# EAGLE design SATELLITE (EAGLE 8.5.1)
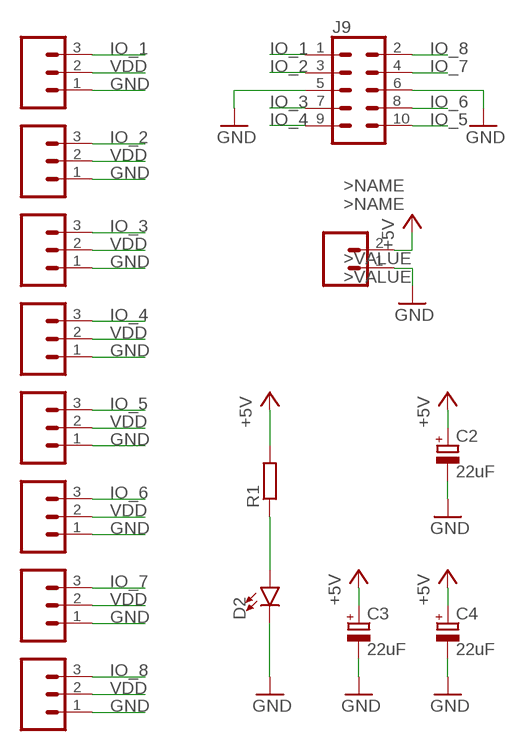
[diagram p0: schematic, sheet 1]

## Parts
C2  22uF  CPOL-EUE2-5  [E2-5]
C3  22uF  CPOL-EUE2-5  [E2-5]
C4  22uF  CPOL-EUE2-5  [E2-5]
D2  LED3MM  [LED_3MM]
J1  CONN_03POLAR  [MOLEX-1X3]
J2  CONN_03POLAR  [MOLEX-1X3]
J3  CONN_03POLAR  [MOLEX-1X3]
J4  CONN_03POLAR  [MOLEX-1X3]
J5  CONN_03POLAR  [MOLEX-1X3]
J6  CONN_03POLAR  [MOLEX-1X3]
J7  CONN_03POLAR  [MOLEX-1X3]
J8  CONN_03POLAR  [MOLEX-1X3]
J9  CONN_05X2SHD  [2X5-SHROUDED]
J10  CONN_02POLAR  [MOLEX-1X2]
R1  R-EU_0204/7  [0204/7]

## Nets
GND: C2.- C3.- C4.- D2.K(C) J1.1 J2.1 J3.1 J4.1 J5.1 J6.1 J7.1 J8.1 J9.5 J9.6 J10.1
IO_1: J7.3 J9.1
IO_2: J8.3 J9.3
IO_3: J1.3 J9.7
IO_4: J2.3 J9.9
IO_5: J3.3 J9.10
IO_6: J4.3 J9.8
IO_7: J5.3 J9.4
IO_8: J6.3 J9.2
N$12: D2.A R1.1
VDD: C2.+ C3.+ C4.+ J1.2 J2.2 J3.2 J4.2 J5.2 J6.2 J7.2 J8.2 J10.2 R1.2 ; supply symbol labelled +5V

## Library data of the parts
C2-C4 = rcl:CPOL-EU: POLARIZED CAPACITOR, European symbol
D2 = OPENBOT:LED: LED (Generic) Standard schematic elements and footprints for 5mm, 3mm, 1206, and 0603 sized LEDs. Generic LEDs with no color specified.; PROD_ID: DIO-08794
J1-J8 = OPENBOT:CONN_03: Multi connection point. Often used as Generic Header-pin footprint for 0.1 inch spaced/style header connections On any of the 0.1 inch spaced packages, you can populate with these: Break Away Headers - Straight <https://www.sparkfun.com/products/116> (PRT-00116) Break Away Male Headers - Right Angle <https://www.sparkfun.com/products/553> (PRT-00553) Female Headers <https://www.sparkfun.com/products/115> (PRT-00115) Break Away Headers - Machine Pin <https://www.sparkfun.com/products/117> (PRT-00117) Break Away Female Headers - Swiss Machine Pin <https://www.sparkfun.com/products/743> (PRT-00743) Stackable Header - 3 Pin (Female, 0.1") <https://www.sparkfun.com/products/13875> (PRT-13875) For SCREWTERMINALS and SPRING TERMINALS visit here: Screw Terimnals on SparkFun.com <https://www.sparkfun.com/search/results?term=Screw+Terminals> (5mm/3.5mm/2.54mm spacing) This device is also useful as a general connection point to wire up your design to another part of your project. Our various solder wires solder well into these plated through hole pads. Hook-Up Wire - Assortment (Stranded, 22 AWG) <https://www.sparkfun.com/products/11375> (PRT-11375) Hook-Up Wire - Assortment (Solid Core, 22 AWG) <https://www.sparkfun.com/products/11367> (PRT-11367) View the entire wire category on our website here <https://www.sparkfun.com/categories/141> Special notes: Molex polarized connector foot print use with SKU : PRT-08232 with associated crimp pins and housings. Multi connection point. Often used as Generic Header-pin footprint for 0.1 inch spaced/style header connections On any of the 0.1 inch spaced packages, you can populate with these: Break Away Headers - Straight <https://www.sparkfun.com/products/116> (PRT-00116) Break Away Male Headers - Right Angle <https://www.sparkfun.com/products/553> (PRT-00553) Female Headers <https://www.sparkfun.com/products/115> (PRT-00115) Break Away Headers - Machine Pin <https://www.sparkfun.com/products/117> (PRT-00117) Break Away Female Headers - Swiss Machine Pin <https://www.sparkfun.com/products/743> (PRT-00743) Stackable Header - 3 Pin (Female, 0.1") <https://www.sparkfun.com/products/13875> (PRT-13875) For SCREWTERMINALS and SPRING TERMINALS visit here: Screw Terimnals on SparkFun.com <https://www.sparkfun.com/search/results?term=Screw+Terminals> (5mm/3.5mm/2.54mm spacing) This device is also useful as a general connection point to wire up your design to another part of your project. Our various solder wires solder well into these plated through hole pads. Hook-Up Wire - Assortment (Stranded, 22 AWG) <https://www.sparkfun.com/products/11375> (PRT-11375) Hook-Up Wire - Assortment (Solid Core, 22 AWG) <https://www.sparkfun.com/products/11367> (PRT-11367) View the entire wire category on our website here <https://www.sparkfun.com/categories/141> Special notes: Molex polarized connector foot print use with SKU : PRT-08232 with associated crimp pins and housings.; PROD_ID: CONN-08625; SF_ID: PRT-08096
J9 = OPENBOT:CONN_05X2: Multi connection point. Often used as Generic Header-pin footprint for 0.1 inch spaced/style header connections For AVR SPI programming port, see special device with nice symbol: "AVR_SPI_PROG_5x2.dev" You can populate with any combo of single row headers, but if you'd like an exact match, check these: 2x5 AVR ICSP Male Header <https://www.sparkfun.com/products/778> (PRT-00778) 2x5 Pin Shrouded Header <https://www.sparkfun.com/products/8506> (PRT-08506) On any of the 0.1 inch spaced packages, you can populate with these: Break Away Headers - Straight <https://www.sparkfun.com/products/116> (PRT-00116) Break Away Male Headers - Right Angle <https://www.sparkfun.com/products/553> (PRT-00553) Female Headers <https://www.sparkfun.com/products/115> (PRT-00115) Break Away Headers - Machine Pin <https://www.sparkfun.com/products/117> (PRT-00117) Break Away Female Headers - Swiss Machine Pin <https://www.sparkfun.com/products/743> (PRT-00743) Special note: the shrouded connector mates well with our 5x2 ribbon cables: 2x5 Pin IDC Ribbon Cable <https://www.sparkfun.com/products/8535> (PRT-08535); PROD_ID: CONN-08671; SF_ID: PRT-08506
J10 = OPENBOT:CONN_02: Multi connection point. Often used as Generic Header-pin footprint for 0.1 inch spaced/style header connections On any of the 0.1 inch spaced packages, you can populate with these: Break Away Headers - Straight <https://www.sparkfun.com/products/116> (PRT-00116) Break Away Male Headers - Right Angle <https://www.sparkfun.com/products/553> (PRT-00553) Female Headers <https://www.sparkfun.com/products/115> (PRT-00115) Break Away Headers - Machine Pin <https://www.sparkfun.com/products/117> (PRT-00117) Break Away Female Headers - Swiss Machine Pin <https://www.sparkfun.com/products/743> (PRT-00743) For SCREWTERMINALS and SPRING TERMINALS visit here: Screw Terimnals on SparkFun.com <https://www.sparkfun.com/search/results?term=Screw+Terminals> (5mm/3.5mm/2.54mm spacing) This device is also useful as a general connection point to wire up your design to another part of your project. Our various solder wires solder well into these plated through hole pads. Hook-Up Wire - Assortment (Stranded, 22 AWG) <https://www.sparkfun.com/products/11375> (PRT-11375) Hook-Up Wire - Assortment (Solid Core, 22 AWG) <https://www.sparkfun.com/products/11367> (PRT-11367) View the entire wire category on our website here <https://www.sparkfun.com/categories/141> Special notes: Molex polarized connector foot print use with: PRT-08233 with associated crimp pins and housings. 2.54_SCREWTERM for use with PRT-10571. 3.5mm Screw Terminal footprints for PRT-08084 5mm Screw Terminal footprints for use with PRT-08432 Multi connection point. Often used as Generic Header-pin footprint for 0.1 inch spaced/style header connections On any of the 0.1 inch spaced packages, you can populate with these: Break Away Headers - Straight <https://www.sparkfun.com/products/116> (PRT-00116) Break Away Male Headers - Right Angle <https://www.sparkfun.com/products/553> (PRT-00553) Female Headers <https://www.sparkfun.com/products/115> (PRT-00115) Break Away Headers - Machine Pin <https://www.sparkfun.com/products/117> (PRT-00117) Break Away Female Headers - Swiss Machine Pin <https://www.sparkfun.com/products/743> (PRT-00743) For SCREWTERMINALS and SPRING TERMINALS visit here: Screw Terimnals on SparkFun.com <https://www.sparkfun.com/search/results?term=Screw+Terminals> (5mm/3.5mm/2.54mm spacing) This device is also useful as a general connection point to wire up your design to another part of your project. Our various solder wires solder well into these plated through hole pads. Hook-Up Wire - Assortment (Stranded, 22 AWG) <https://www.sparkfun.com/products/11375> (PRT-11375) Hook-Up Wire - Assortment (Solid Core, 22 AWG) <https://www.sparkfun.com/products/11367> (PRT-11367) View the entire wire category on our website here <https://www.sparkfun.com/categories/141> Special notes: Molex polarized connector foot print use with: PRT-08233 with associated crimp pins and housings. 2.54_SCREWTERM for use with PRT-10571. 3.5mm Screw Terminal footprints for PRT-08084 5mm Screw Terminal footprints for use with PRT-08432; SF_ID: PRT-09918
R1 = rcl:R-EU_: RESISTOR, European symbol

## Board
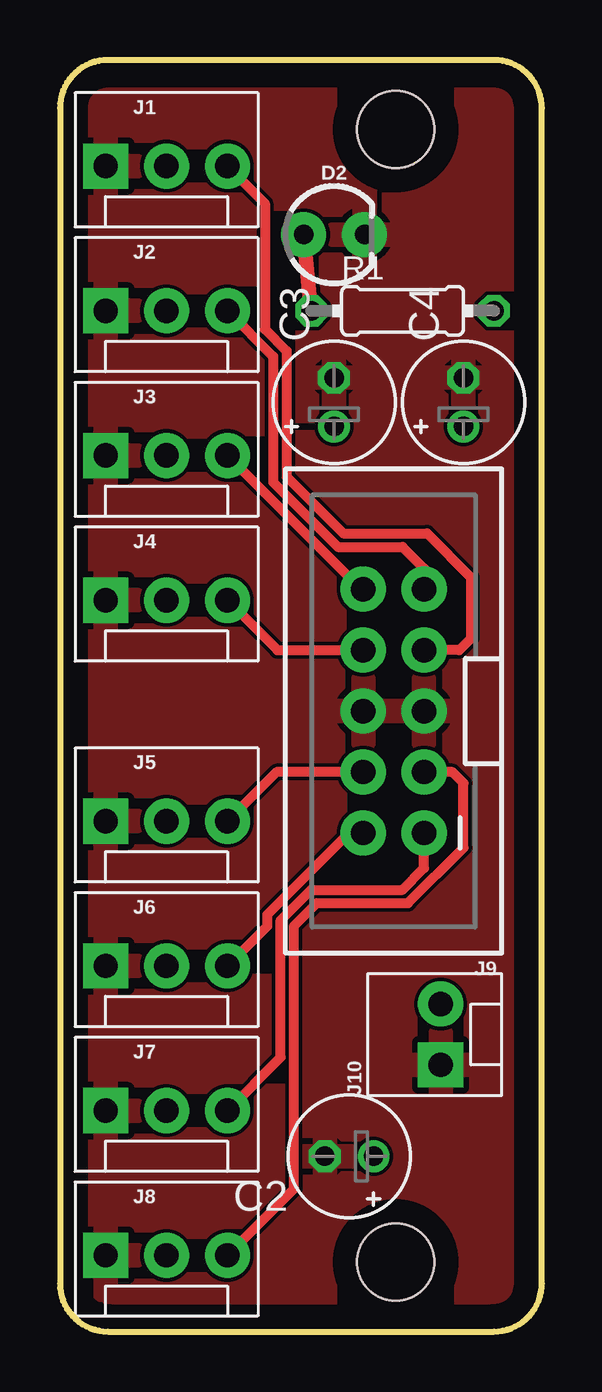
[diagram p1: board, top side]
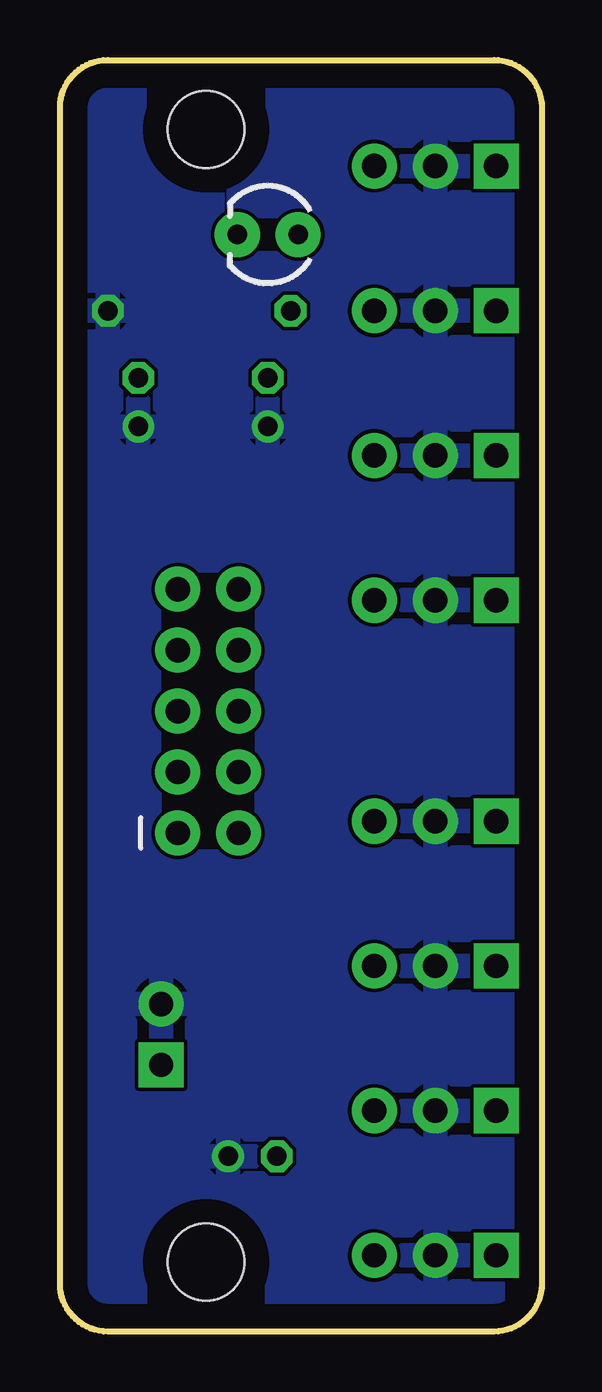
[diagram p2: board, bottom side, seen from below]

Size 20.09 x 53 mm. Coordinates in mm from the lower left corner, seen from the top.
Outline: 0,2 arc90 2,0 18.09,0 arc90 20.09,2 20.09,51 arc90 18.09,53 2,53 arc90 0,51 0,2
Copper layers (1*16): Top 0.035mm / dielectric 1.5mm / Bottom 0.035mm
Design rules "default": minimum track width 6mil, minimum drill 0.35mm, track to track 6mil, track to pad 6mil, pad to pad 6mil, via to via 6mil, smd to smd 6mil, copper to edge 40mil, drill to drill 6mil, minimum pad ring 10mil, minimum via ring 8mil, stop-mask expansion 4mil, vias tented up to drill 0mil, thermal gap 10mil
Holes 3.2 mm at 14,2.9 14,50.1

### Footprints (pad centres in the part's own frame; a part is rotated, then mirrored left to right if it is on the bottom)
E2-5 = drill 0.813 pad 1.27: + -1.016,0 | drill 0.813 pad 1.27 octagon: - 1.016,0
LED_3MM = drill 0.813 pad 1.88: A -1.27,0; K 1.27,0
MOLEX-1X3 = drill 1.016 pad 1.88 square: 1 0,0 | drill 1.016 pad 1.88: 2 2.54,0; 3 5.08,0
2X5-SHROUDED = drill 1.016 pad 1.88: 1 -1.27,5.08; 2 1.27,5.08; 3 -1.27,2.54; 4 1.27,2.54; 5 -1.27,0; 6 1.27,0; 7 -1.27,-2.54; 8 1.27,-2.54; 9 -1.27,-5.08; 10 1.27,-5.08
MOLEX-1X2 = drill 1.016 pad 1.88 square: 1 0,0 | drill 1.016 pad 1.88: 2 2.54,0
0204/7 = drill 0.813 octagon: 1 -3.81,0; 2 3.81,0

### Placement (x,y rotation side)
C2  12.06,7.3 180 top
C3  11.43,38.73 90 top
C4  16.83,38.73 90 top
D2  11.43,45.72 0 top
J1  1.91,48.58 0 top
J2  1.91,42.55 0 top
J3  1.91,36.51 0 top
J4  1.91,30.48 0 top
J5  1.91,21.27 0 top
J6  1.91,15.24 0 top
J7  1.91,9.21 0 top
J8  1.91,3.18 0 top
J9  13.92,25.86 180 top
J10  15.88,11.11 90 top
R1  14.29,42.55 0 top

### Tracks (layer width: path | path; a pad name or v marks a point on that pad's centre or on a via)
GND
  pour Top: -1.91,53.34 24.13,53.34 24.13,-1.91 -1.91,-1.91
IO_1
  Top 0.406: J7.3 9.21,11.43 9.21,17.14 10.48,18.41 14.29,18.41 15.19,19.31 J9.1
IO_2
  Top 0.406: J8.3 9.77,5.96 9.77,16.91 10.71,17.86 14.52,17.86 16.83,20.16 16.83,22.86 16.37,23.32 J9.3
IO_3
  Top 0.406: J1.3 8.55,47.02 8.55,41.77 9.45,40.87 9.45,35.63 11.82,33.26 15.32,33.26 17.14,31.43 17.14,28.89 16.65,28.4 J9.7
IO_4
  Top 0.406: J2.3 8.89,40.64 8.89,35.4 11.59,32.7 14.29,32.7 15.19,31.8 J9.9
IO_5
  Top 0.406: J3.3 12.56,30.94 J9.10
IO_6
  Top 0.406: J4.3 9.06,28.4 J9.8
IO_7
  Top 0.406: J9.4 9.03,23.32 J5.3
IO_8
  Top 0.406: J6.3 8.65,16.9 8.65,17.38 12.05,20.78 J9.2
N$12
  Top 0.61: D2.A R1.1
VDD
  pour Bottom: -2.22,53.66 24.45,53.66 24.45,-2.22 -2.22,-2.22